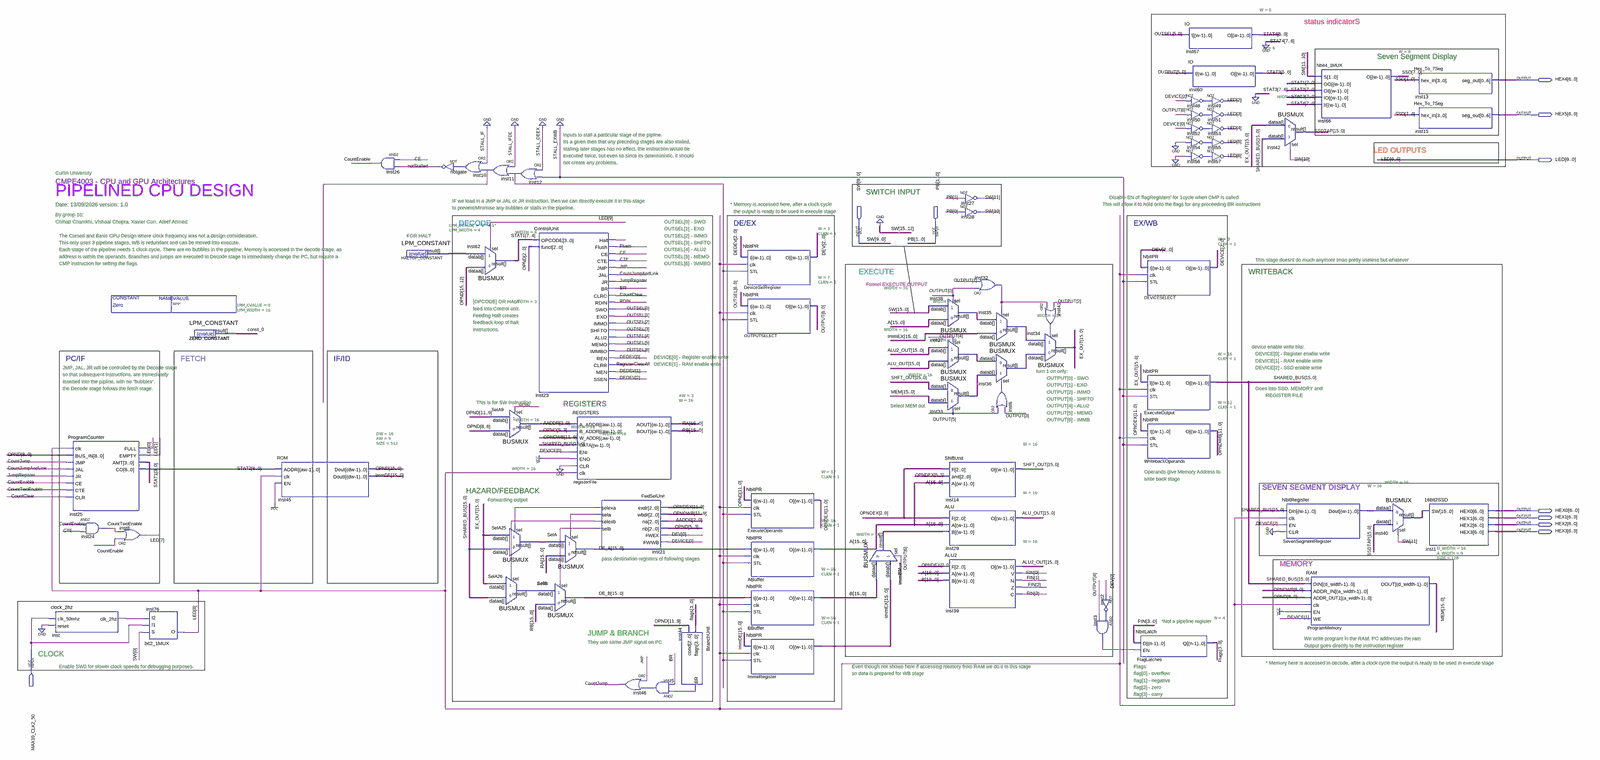
[diagram p0: schematic sheet, whole]
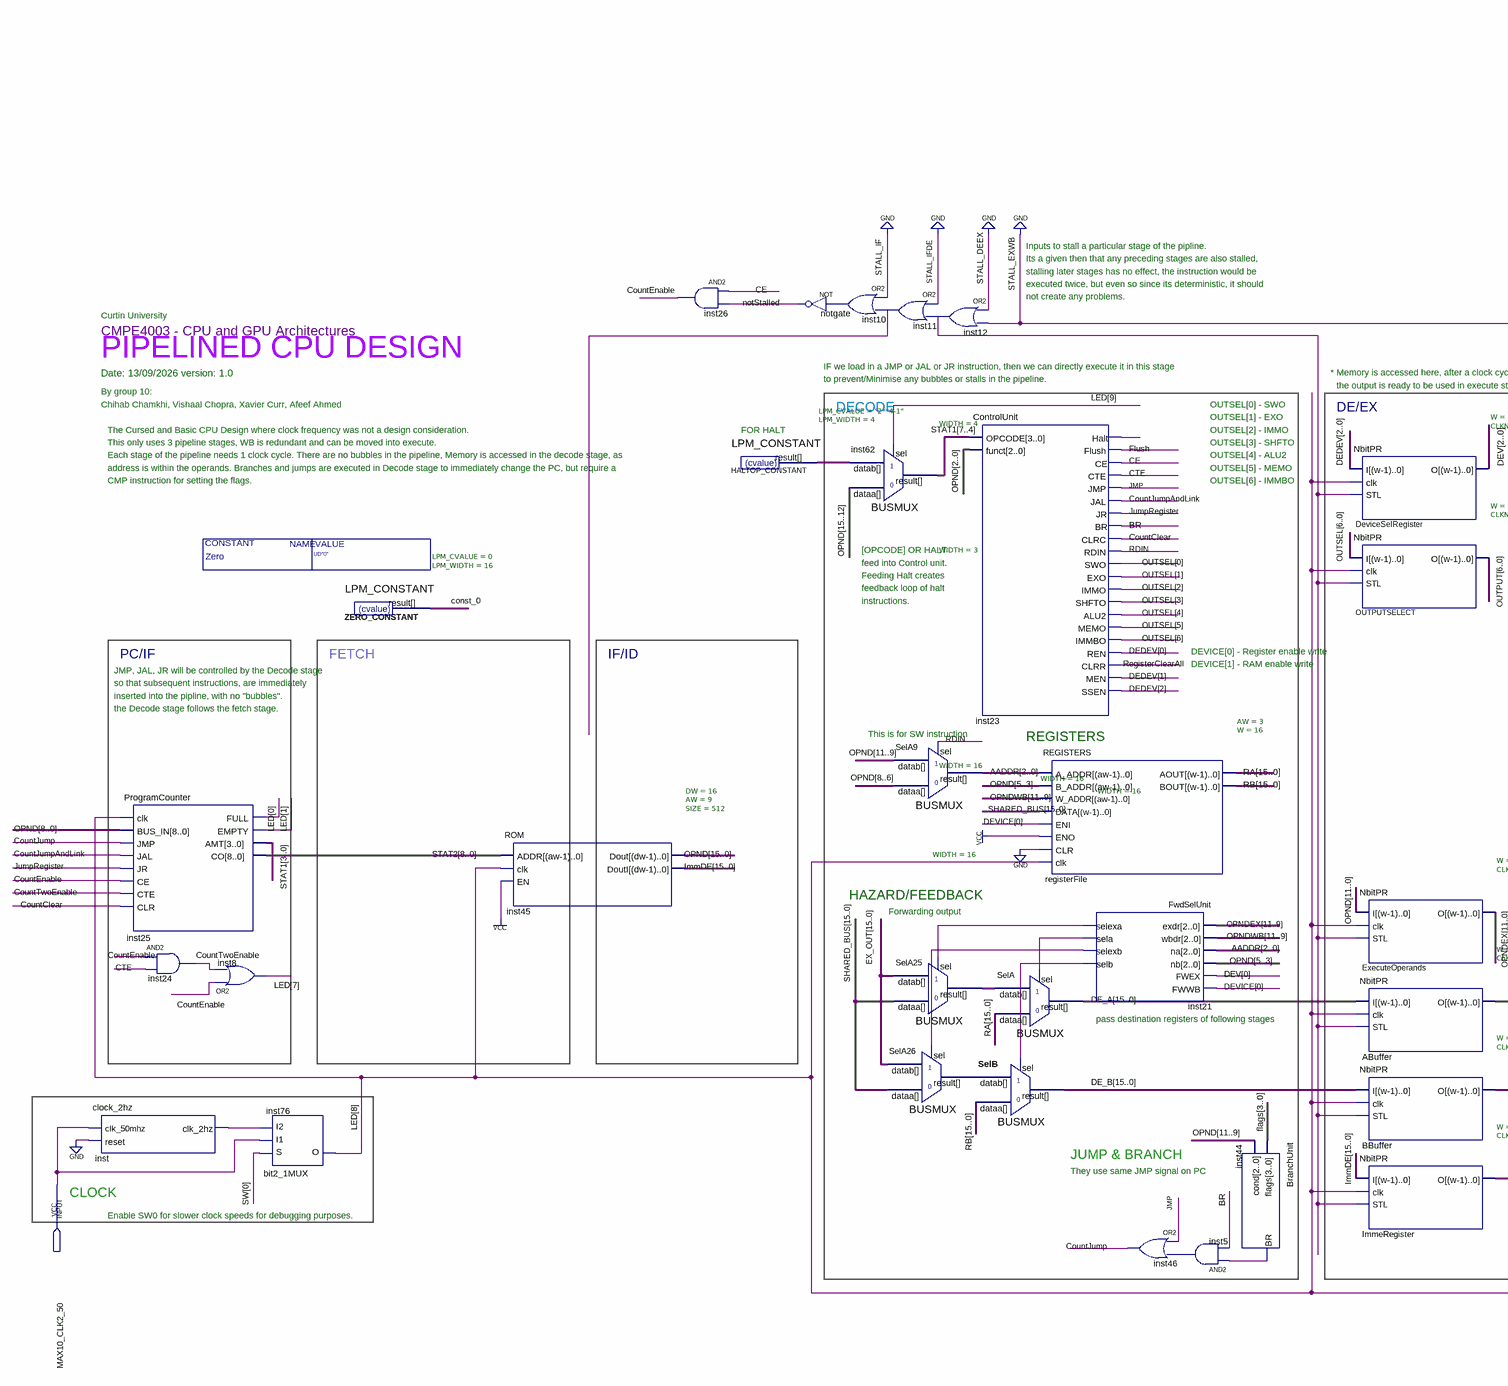
[diagram p1: schematic sheet, left part]
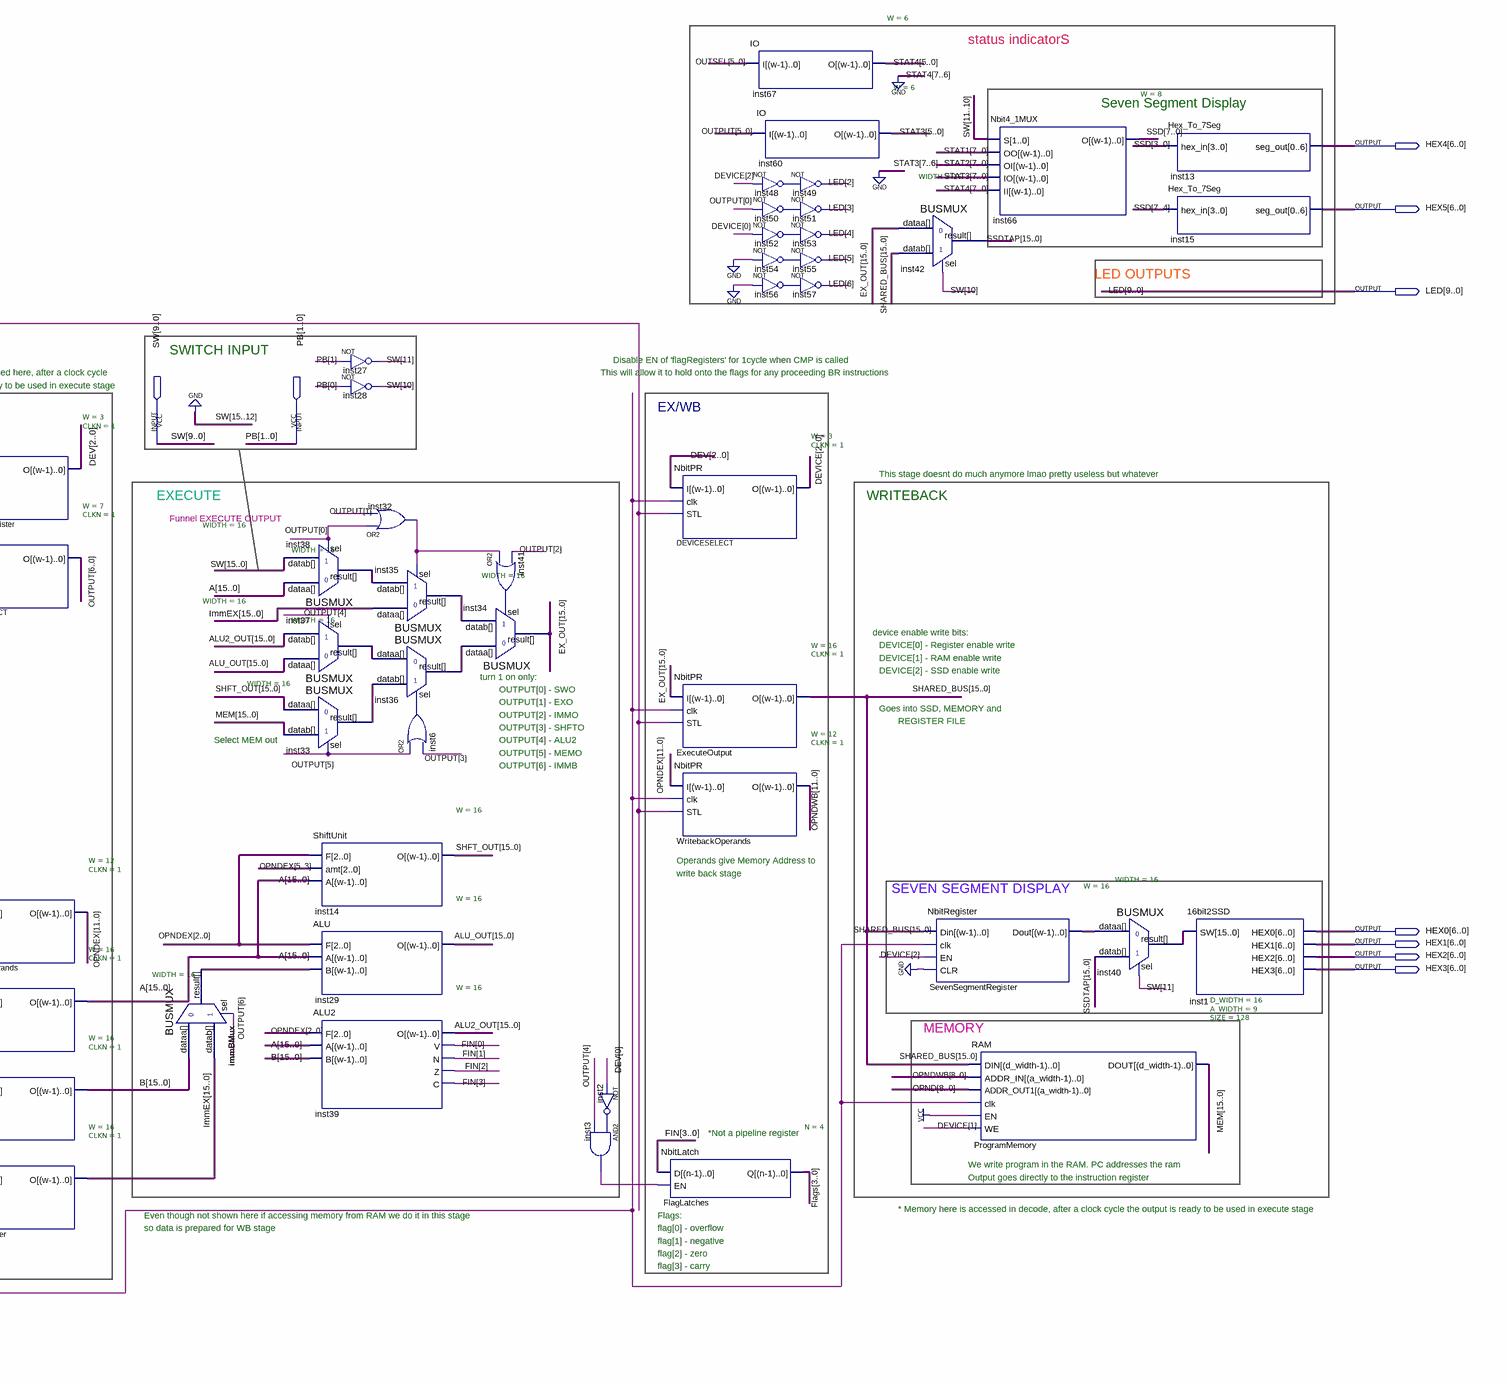
[diagram p2: schematic sheet, right part]
// Quartus schematic BasicCPU.bdf as structural Verilog: 72 symbols, 10 pins
module BasicCPU #(parameter Zero = "UD\"0\"") (
  input  [11:0] SW,
  input  [1:0] PB,
  input  MAX10_CLK2_50,
  output [6:0] HEX4,
  output [6:0] HEX5,
  output [9:0] LED,
  output [6:0] HEX0,
  output [6:0] HEX1,
  output [6:0] HEX2,
  output [6:0] HEX3
);

  wire BR, CE, const_0, CountClear, CountEnable, CountJump, CountJumpAndLink, CountTwoEnable, CTE, Flush,
       inst2_out, inst3_out, inst5_out, inst6_out, inst10_out, inst11_out, inst12_out, inst21_sela,
       inst21_selb, inst21_selexa, inst21_selexb, inst23_halt, inst32_out, inst41_out, inst44_br, inst48_out,
       inst50_out, inst52_out, inst54_out, inst56_out, inst_clk_2hz, JMP, JumpRegister, notStalled, RDIN,
       RegisterClearAll;
  wire [2:0] AADDR, DEDEV, DEV, DEVICE;
  wire [3:0] FIN, flags, HALTOP_CONSTANT_result;
  wire [5:0] STAT3, STAT4;
  wire [6:0] OUTPUT, OUTSEL;
  wire [7:0] SSD, STAT1;
  wire [8:0] STAT2;
  wire [11:0] OPNDEX, OPNDWB;
  wire [15:0] A, ALU2_OUT, ALU_OUT, B, DE_A, DE_B, EX_OUT, immBMux_result, ImmDE, ImmEX, inst33_result,
       inst35_result, inst36_result, inst37_result, inst38_result, inst40_result, MEM, OPND, RA, RB,
       SelA25_result, SelA26_result, SevenSegmentRegister_dout, SHARED_BUS, SHFT_OUT, SSDTAP;

  ProgramCounter inst25 (
    .clk(LED[8]), .BUS_IN(OPND[8:0]), .JMP(CountJump), .JAL(CountJumpAndLink), .JR(JumpRegister),
    .CE(CountEnable), .CTE(CountTwoEnable), .CLR(CountClear), .FULL(LED[0]), .EMPTY(LED[1]),
    .AMT(STAT1[3:0]), .CO(STAT2));
  clock_2hz inst (.clk_50mhz(MAX10_CLK2_50), .reset(1'b0), .clk_2hz(inst_clk_2hz));
  and inst24 (CountTwoEnable, CountEnable, CTE);
  or inst8 (LED[7], CountEnable, CountTwoEnable);
  bit2_1MUX inst76 (.S(SW[0]), .I1(MAX10_CLK2_50), .I2(inst_clk_2hz), .O(LED[8]));
  LPM_CONSTANT #(.LPM_CVALUE(0), .LPM_WIDTH(16)) ZERO_CONSTANT (.result(const_0));
  ROM #(.DW(16), .AW(9), .SIZE(512)) inst45 (.ADDR(STAT2), .clk(LED[8]), .EN(1'b1), .Dout(OPND), .DoutI(ImmDE));
  and inst26 (CountEnable, CE, notStalled);
  LPM_CONSTANT #(.LPM_CVALUE("2**4-1"), .LPM_WIDTH(4)) HALTOP_CONSTANT (.result(HALTOP_CONSTANT_result));
  or inst10 (inst10_out, 1'b0, inst11_out);
  not notgate (notStalled, inst10_out);
  or inst11 (inst11_out, 1'b0, inst12_out);
  BUSMUX #(.WIDTH(4)) inst62 (.datab(HALTOP_CONSTANT_result), .sel(LED[9]), .dataa(OPND[15:12]), .result(STAT1[7:4]));
  BUSMUX #(.WIDTH(16)) SelA26 (.datab(EX_OUT), .sel(inst21_selexb), .dataa(SHARED_BUS), .result(SelA26_result));
  or inst12 (inst12_out, 1'b0, 1'b0);
  BUSMUX #(.WIDTH(3)) SelA9 (.datab(OPND[11:9]), .sel(RDIN), .dataa(OPND[8:6]), .result(AADDR));
  BUSMUX #(.WIDTH(16)) SelA25 (.datab(EX_OUT), .sel(inst21_selexa), .dataa(SHARED_BUS), .result(SelA25_result));
  ControlUnit inst23 (
    .OPCODE(STAT1[7:4]), .funct(OPND[2:0]), .Halt(inst23_halt), .Flush(Flush), .CE(CE), .CTE(CTE), .JMP(JMP),
    .JAL(CountJumpAndLink), .JR(JumpRegister), .BR(BR), .CLRC(CountClear), .RDIN(RDIN), .SWO(OUTSEL[0]),
    .EXO(OUTSEL[1]), .IMMO(OUTSEL[2]), .SHFTO(OUTSEL[3]), .ALU2(OUTSEL[4]), .MEMO(OUTSEL[5]),
    .IMMBO(OUTSEL[6]), .REN(DEDEV[0]), .CLRR(RegisterClearAll), .MEN(DEDEV[1]), .SSEN(DEDEV[2]));
  BUSMUX #(.WIDTH(16)) SelB (.datab(SelA26_result), .sel(inst21_selb), .dataa(RB), .result(DE_B));
  REGISTERS #(.AW(3), .W(16)) registerFile (
    .A_ADDR(AADDR), .B_ADDR(OPND[5:3]), .W_ADDR(OPNDWB[11:9]), .DATA(SHARED_BUS), .ENI(DEVICE[0]),
    .ENO(1'b1), .CLR(1'b0), .clk(LED[8]), .AOUT(RA), .BOUT(RB));
  BUSMUX #(.WIDTH(16)) SelA (.datab(SelA25_result), .sel(inst21_sela), .dataa(RA), .result(DE_A));
  FwdSelUnit inst21 (
    .exdr(OPNDEX[11:9]), .wbdr(OPNDWB[11:9]), .na(AADDR), .nb(OPND[5:3]), .FWEX(DEV[0]), .FWWB(DEVICE[0]),
    .selexa(inst21_selexa), .sela(inst21_sela), .selexb(inst21_selexb), .selb(inst21_selb));
  or inst46 (CountJump, JMP, inst5_out);
  and inst5 (inst5_out, inst44_br, BR);
  BranchUnit inst44 (.flags(flags), .cond(OPND[11:9]), .BR(inst44_br));
  NbitPR #(.W(3), .CLKN(1)) DeviceSelRegister (.I(DEDEV), .clk(LED[8]), .STL(inst12_out), .O(DEV));
  NbitPR #(.W(7), .CLKN(1)) OUTPUTSELECT (.I(OUTSEL), .clk(LED[8]), .STL(inst12_out), .O(OUTPUT));
  NbitPR #(.W(12), .CLKN(1)) ExecuteOperands (.I(OPND[11:0]), .clk(LED[8]), .STL(inst12_out), .O(OPNDEX));
  NbitPR #(.W(16), .CLKN(1)) ABuffer (.I(DE_A), .clk(LED[8]), .STL(inst12_out), .O(A));
  NbitPR #(.W(16), .CLKN(1)) BBuffer (.I(DE_B), .clk(LED[8]), .STL(inst12_out), .O(B));
  NbitPR #(.W(16), .CLKN(1)) ImmeRegister (.I(ImmDE), .clk(LED[8]), .STL(inst12_out), .O(ImmEX));
  BUSMUX #(.WIDTH(16)) immBMux (.datab(ImmEX), .sel(OUTPUT[6]), .dataa(B), .result(immBMux_result));
  BUSMUX #(.WIDTH(16)) inst38 (.datab({4'b0000, SW}), .sel(OUTPUT[0]), .dataa(A), .result(inst38_result));
  BUSMUX #(.WIDTH(16)) inst37 (.datab(ALU2_OUT), .sel(OUTPUT[4]), .dataa(ALU_OUT), .result(inst37_result));
  BUSMUX #(.WIDTH(16)) inst33 (.datab(MEM), .sel(OUTPUT[5]), .dataa(SHFT_OUT), .result(inst33_result));
  not inst27 (SW[11], PB[1]);
  not inst28 (SW[10], PB[0]);
  ShiftUnit #(.W(16)) inst14 (.F(OPNDEX[2:0]), .amt(OPNDEX[5:3]), .A(A), .O(SHFT_OUT));
  ALU #(.W(16)) inst29 (.F(OPNDEX[2:0]), .A(A), .B(immBMux_result), .O(ALU_OUT));
  ALU2 #(.W(16)) inst39 (.F(OPNDEX[2:0]), .A(A), .B(B), .O(ALU2_OUT), .V(FIN[0]), .N(FIN[1]), .Z(FIN[2]), .C(FIN[3]));
  or inst32 (inst32_out, OUTPUT[0], OUTPUT[1]);
  BUSMUX #(.WIDTH(16)) inst35 (.datab(inst38_result), .sel(inst32_out), .dataa(ImmEX), .result(inst35_result));
  BUSMUX #(.WIDTH(16)) inst36 (.datab(inst33_result), .sel(inst6_out), .dataa(inst37_result), .result(inst36_result));
  or inst6 (inst6_out, OUTPUT[5], OUTPUT[3]);
  or inst41 (inst41_out, inst32_out, OUTPUT[2]);
  BUSMUX #(.WIDTH(16)) inst34 (.datab(inst35_result), .sel(inst41_out), .dataa(inst36_result), .result(EX_OUT));
  not inst2 (inst2_out, DEV[0]);
  and inst3 (inst3_out, inst2_out, OUTPUT[4]);
  NbitPR #(.W(3), .CLKN(1)) DEVICESELECT (.I(DEV), .clk(LED[8]), .STL(1'b0), .O(DEVICE));
  NbitPR #(.W(16), .CLKN(1)) ExecuteOutput (.I(EX_OUT), .clk(LED[8]), .STL(1'b0), .O(SHARED_BUS));
  NbitPR #(.W(12), .CLKN(1)) WritebackOperands (.I(OPNDEX), .clk(LED[8]), .STL(1'b0), .O(OPNDWB));
  NbitLatch #(.N(4)) FlagLatches (.D(FIN), .EN(inst3_out), .Q(flags));
  IO #(.W(6)) inst67 (.I(OUTSEL[5:0]), .O(STAT4));
  IO #(.W(6)) inst60 (.I(OUTPUT[5:0]), .O(STAT3));
  not inst48 (inst48_out, DEVICE[2]);
  not inst49 (LED[2], inst48_out);
  not inst50 (inst50_out, OUTPUT[0]);
  not inst51 (LED[3], inst50_out);
  not inst52 (inst52_out, DEVICE[0]);
  not inst53 (LED[4], inst52_out);
  not inst54 (inst54_out, 1'b0);
  not inst55 (LED[5], inst54_out);
  not inst56 (inst56_out, 1'b0);
  not inst57 (LED[6], inst56_out);
  BUSMUX #(.WIDTH(16)) inst42 (.datab(SHARED_BUS), .sel(SW[10]), .dataa(EX_OUT), .result(SSDTAP));
  NbitRegister #(.W(16)) SevenSegmentRegister (
    .Din(SHARED_BUS), .clk(LED[8]), .EN(DEVICE[2]), .CLR(1'b0), .Dout(SevenSegmentRegister_dout));
  Nbit4_1MUX #(.W(8)) inst66 (
    .S(SW[11:10]), .OO(STAT1), .OI(STAT2[7:0]), .IO({2'b00, STAT3}), .II({2'b00, STAT4}), .O(SSD));
  RAM #(.D_WIDTH(16), .A_WIDTH(9), .SIZE(128)) ProgramMemory (
    .DIN(SHARED_BUS), .ADDR_IN(OPNDWB[8:0]), .ADDR_OUT1(OPND[8:0]), .clk(LED[8]), .EN(1'b1), .WE(DEVICE[1]),
    .DOUT(MEM));
  BUSMUX #(.WIDTH(16)) inst40 (.datab(SSDTAP), .sel(SW[11]), .dataa(SevenSegmentRegister_dout), .result(inst40_result));
  Hex_To_7Seg inst13 (.hex_in(SSD[3:0]), .seg_out(HEX4));
  Hex_To_7Seg inst15 (.hex_in(SSD[7:4]), .seg_out(HEX5));
  \16bit2SSD  inst1 (.SW(inst40_result), .HEX0(HEX0), .HEX1(HEX1), .HEX2(HEX2), .HEX3(HEX3));

  // Notes on the sheet:
  //   status indicatorS
  //   Seven Segment Display
  //   Inputs to stall a particular stage of the pipline.
  //   Its a given then that any preceding stages are also stalled,
  //   stalling later stages has no effect, the instruction would be 
  //   LED OUTPUTS
  //   executed twice, but even so since its deterministic, it should
  //   not create any problems.
  //   Curtin University
  //   CMPE4003 - CPU and GPU Architectures
  //   PIPELINED CPU DESIGN
  //   SWITCH INPUT
  //   Disable EN of 'flagRegisters' for 1cycle when CMP is called
  //   IF we load in a JMP or JAL or JR instruction, then we can directly execute it in this stage
  //   Date: 13/09/2026 version: 1.0 
  //   * Memory is accessed here, after a clock cycle 
  //   This will allow it to hold onto the flags for any proceeding BR instructions 
  //   to prevent/Minimise any bubbles or stalls in the pipeline.
  //   the output is ready to be used in execute stage
  //   By group 10:
  //   Chihab Chamkhi, Vishaal Chopra, Xavier Curr, Afeef Ahmed
  //   DECODE
  //   OUTSEL[0] - SWO
  //   DE/EX
  //   EX/WB
  //   OUTSEL[1] - EXO
  //   The Cursed and Basic CPU Design where clock frequency was not a design consideration.
  //   FOR HALT
  //   OUTSEL[2] - IMMO
  //   This only uses 3 pipeline stages, WB is redundant and can be moved into execute.
  //   OUTSEL[3] - SHFTO
  //   Each stage of the pipeline needs 1 clock cycle. There are no bubbles in the pipeline, Memory is accessed in the decode stage, as
  //   OUTSEL[4] - ALU2
  //   address is within the operands. Branches and jumps are executed in Decode stage to immediately change the PC, but require a
  //   OUTSEL[5] - MEMO
  //   This stage doesnt do much anymore lmao pretty useless but whatever
  //   CMP instruction for setting the flags.
  //   OUTSEL[6] - IMMBO
  //   EXECUTE
  //   WRITEBACK
  //   Funnel EXECUTE OUTPUT
  //   [OPCODE] OR HALT
  //   feed into Control unit.
  //   Feeding Halt creates
  //   feedback loop of halt
  //   instructions.
  //   device enable write bits:
  //   DEVICE[0] - Register enable write
  //   PC/IF
  //   FETCH
  //   IF/ID
  //   DEVICE[0] - Register enable write
  //   DEVICE[1] - RAM enable write
  //   DEVICE[1] - RAM enable write
  //   JMP, JAL, JR will be controlled by the Decode stage 
  //   DEVICE[2] - SSD enable write
  //   turn 1 on only:
  //   so that subsequent instructions, are immediately
  //   OUTPUT[0] - SWO
  //   inserted into the pipline, with no "bubbles".
  //   OUTPUT[1] - EXO
  //   the Decode stage follows the fetch stage.
  //   Goes into SSD, MEMORY and
  //   OUTPUT[2] - IMMO
  //   REGISTER FILE
  //   OUTPUT[3] - SHFTO
  //   This is for SW instruction
  //   REGISTERS
  //   Select MEM out
  //   OUTPUT[4] - ALU2
  //   OUTPUT[5] - MEMO
  //   OUTPUT[6] - IMMB
  //   Operands give Memory Address to
  //   write back stage
  //   SEVEN SEGMENT DISPLAY
  //   HAZARD/FEEDBACK
  //   Forwarding output
  //   pass destination registers of following stages
  //   MEMORY
  //   *Not a pipeline register
  //   JUMP & BRANCH
  //   We write program in the RAM. PC addresses the ram
  //   They use same JMP signal on PC
  //   Output goes directly to the instruction register
  //   CLOCK
  //   * Memory here is accessed in decode, after a clock cycle the output is ready to be used in execute stage
  //   Enable SW0 for slower clock speeds for debugging purposes.
  //   Even though not shown here if accessing memory from RAM we do it in this stage
  //   Flags:
  //   so data is prepared for WB stage
  //   flag[0] - overflow
  //   flag[1] - negative
  //   flag[2] - zero
  //   flag[3] - carry
endmodule
